# Altium project IFE_TSAL_Light_2019_v2_Altium.PrjPcb
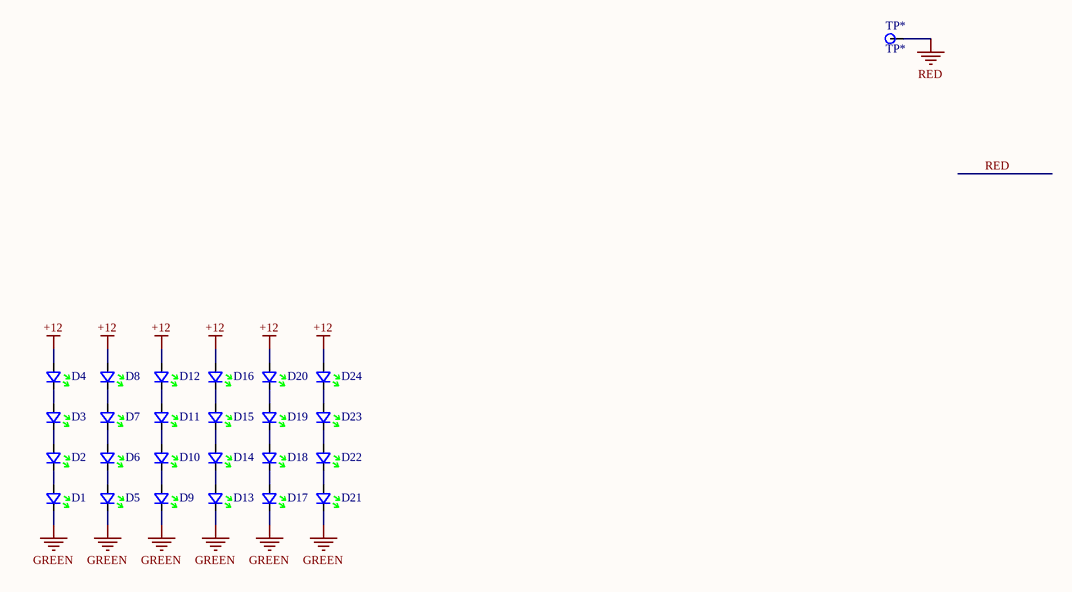
[diagram p0: ife19_Elec_TS_TSAL_Light.SchDoc]
1 sheet, 25 parts. Net scope: global (net labels, ports and power ports of the same name join across sheets).
Board file: ife19_Elec_TS_TSAL_Light.PcbDoc

## Sheet ife19_Elec_TS_TSAL_Light.SchDoc
size A

### Parts
D1  LEDGREEN-1806-RIGHT  [LEDGREEN-1806-RIGHT]  (value not drawn)
D2  LEDGREEN-1806-RIGHT  [LEDGREEN-1806-RIGHT]  (value not drawn)
D3  LEDGREEN-1806-RIGHT  [LEDGREEN-1806-RIGHT]  (value not drawn)
D4  LEDGREEN-1806-RIGHT  [LEDGREEN-1806-RIGHT]  (value not drawn)
D5  LEDGREEN-1806-RIGHT  [LEDGREEN-1806-RIGHT]  (value not drawn)
D6  LEDGREEN-1806-RIGHT  [LEDGREEN-1806-RIGHT]  (value not drawn)
D7  LEDGREEN-1806-RIGHT  [LEDGREEN-1806-RIGHT]  (value not drawn)
D8  LEDGREEN-1806-RIGHT  [LEDGREEN-1806-RIGHT]  (value not drawn)
D9  LEDGREEN-1806-RIGHT  [LEDGREEN-1806-RIGHT]  (value not drawn)
D10  LEDGREEN-1806-RIGHT  [LEDGREEN-1806-RIGHT]  (value not drawn)
D11  LEDGREEN-1806-RIGHT  [LEDGREEN-1806-RIGHT]  (value not drawn)
D12  LEDGREEN-1806-RIGHT  [LEDGREEN-1806-RIGHT]  (value not drawn)
D13  LEDGREEN-1806-RIGHT  [LEDGREEN-1806-RIGHT]  (value not drawn)
D14  LEDGREEN-1806-RIGHT  [LEDGREEN-1806-RIGHT]  (value not drawn)
D15  LEDGREEN-1806-RIGHT  [LEDGREEN-1806-RIGHT]  (value not drawn)
D16  LEDGREEN-1806-RIGHT  [LEDGREEN-1806-RIGHT]  (value not drawn)
D17  LEDGREEN-1806-RIGHT  [LEDGREEN-1806-RIGHT]  (value not drawn)
D18  LEDGREEN-1806-RIGHT  [LEDGREEN-1806-RIGHT]  (value not drawn)
D19  LEDGREEN-1806-RIGHT  [LEDGREEN-1806-RIGHT]  (value not drawn)
D20  LEDGREEN-1806-RIGHT  [LEDGREEN-1806-RIGHT]  (value not drawn)
D21  LEDGREEN-1806-RIGHT  [LEDGREEN-1806-RIGHT]  (value not drawn)
D22  LEDGREEN-1806-RIGHT  [LEDGREEN-1806-RIGHT]  (value not drawn)
D23  LEDGREEN-1806-RIGHT  [LEDGREEN-1806-RIGHT]  (value not drawn)
D24  LEDGREEN-1806-RIGHT  [LEDGREEN-1806-RIGHT]  (value not drawn)
TP*  TP*  [Testpoint]

### Nets
+12: D4.A D8.A D12.A D16.A D20.A D24.A
GREEN: D1.K D5.K D9.K D13.K D17.K D21.K
RED: TP*.1
NetD1_A: D1.A D2.K
NetD2_A: D2.A D3.K
NetD3_A: D3.A D4.K
NetD5_A: D5.A D6.K
NetD6_A: D6.A D7.K
NetD7_A: D7.A D8.K
NetD9_A: D9.A D10.K
NetD10_A: D10.A D11.K
NetD11_A: D11.A D12.K
NetD13_A: D13.A D14.K
NetD14_A: D14.A D15.K
NetD15_A: D15.A D16.K
NetD17_A: D17.A D18.K
NetD18_A: D18.A D19.K
NetD19_A: D19.A D20.K
NetD21_A: D21.A D22.K
NetD22_A: D22.A D23.K
NetD23_A: D23.A D24.K

### Library data of the parts
TP* = Testpoint